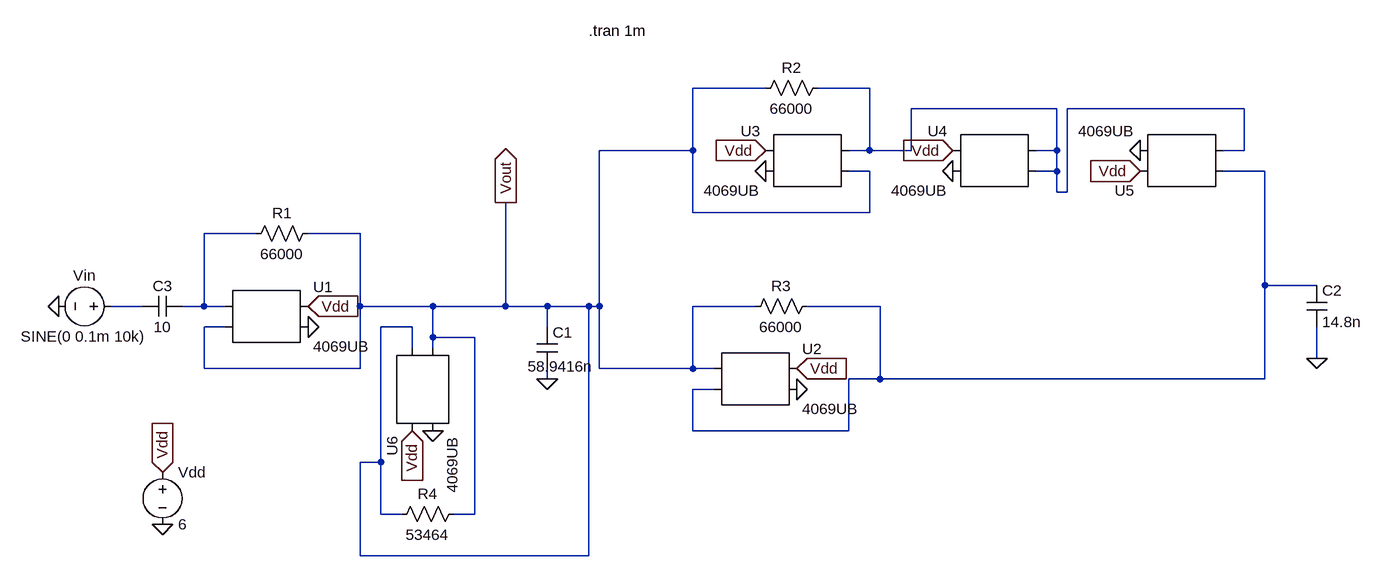
[diagram p0: schematic q2adv1.asc]
q2adv1.asc, the LTspice schematic file:
Version 4
SHEET 1 1144 680
WIRE 176 -368 64 -368
WIRE 336 -368 256 -368
WIRE 624 -336 400 -336
WIRE 912 -336 640 -336
WIRE 64 -272 64 -368
WIRE 64 -272 -80 -272
WIRE 336 -272 336 -368
WIRE 336 -272 304 -272
WIRE 400 -272 400 -336
WIRE 400 -272 336 -272
WIRE 624 -272 624 -336
WIRE 624 -272 592 -272
WIRE 912 -272 912 -336
WIRE 912 -272 880 -272
WIRE 336 -240 304 -240
WIRE 624 -240 624 -272
WIRE 624 -240 592 -240
WIRE 944 -240 880 -240
WIRE 624 -208 624 -240
WIRE 640 -208 640 -336
WIRE 640 -208 624 -208
WIRE 64 -176 64 -272
WIRE 336 -176 336 -240
WIRE 336 -176 64 -176
WIRE -608 -144 -688 -144
WIRE -448 -144 -528 -144
WIRE 944 -64 944 -240
WIRE 1024 -64 944 -64
WIRE -784 -32 -832 -32
WIRE -688 -32 -688 -144
WIRE -688 -32 -720 -32
WIRE -656 -32 -688 -32
WIRE -448 -32 -448 -144
WIRE -336 -32 -448 -32
WIRE -224 -32 -224 -192
WIRE -224 -32 -336 -32
WIRE -160 -32 -224 -32
WIRE -96 -32 -160 -32
WIRE -80 -32 -80 -272
WIRE -80 -32 -96 -32
WIRE 160 -32 64 -32
WIRE 352 -32 240 -32
WIRE -656 0 -688 0
WIRE -368 0 -416 0
WIRE -160 0 -160 -32
WIRE -336 16 -336 -32
WIRE -272 16 -336 16
WIRE -368 32 -368 0
WIRE -336 32 -336 16
WIRE 1024 48 1024 0
WIRE -688 64 -688 0
WIRE -448 64 -448 -32
WIRE -448 64 -688 64
WIRE -80 64 -80 -32
WIRE 64 64 64 -32
WIRE 64 64 -80 64
WIRE 96 64 64 64
WIRE -160 80 -160 64
WIRE 352 80 352 -32
WIRE 352 80 304 80
WIRE 944 80 944 -64
WIRE 944 80 352 80
WIRE 96 96 64 96
WIRE 64 160 64 96
WIRE 304 160 304 80
WIRE 304 160 64 160
WIRE -416 208 -416 0
WIRE -416 208 -448 208
WIRE -416 288 -416 208
WIRE -384 288 -416 288
WIRE -272 288 -272 16
WIRE -272 288 -304 288
WIRE -448 352 -448 208
WIRE -96 352 -96 -32
WIRE -96 352 -448 352
FLAG -912 -32 0
FLAG -160 80 0
FLAG -752 304 0
FLAG -752 224 Vdd
IOPIN -752 224 In
FLAG -528 -32 Vdd
IOPIN -528 -32 In
FLAG 176 -272 Vdd
IOPIN 176 -272 In
FLAG 464 -272 Vdd
IOPIN 464 -272 In
FLAG 752 -240 Vdd
IOPIN 752 -240 In
FLAG 224 64 Vdd
IOPIN 224 64 In
FLAG 224 96 0
FLAG -528 0 0
FLAG 176 -240 0
FLAG 464 -240 0
FLAG 752 -272 0
FLAG -224 -192 Vout
IOPIN -224 -192 Out
FLAG 1024 48 0
FLAG -368 160 Vdd
IOPIN -368 160 In
FLAG -336 160 0
SYMBOL AutoGenerated\\4069UB -592 -16 R0
SYMATTR InstName U1
SYMBOL voltage -816 -32 R90
WINDOW 0 -32 56 VBottom 2
WINDOW 3 31 58 VTop 2
WINDOW 123 60 56 VTop 2
WINDOW 39 0 0 Left 0
SYMATTR InstName Vin
SYMATTR Value SINE(0 0.1m 10k)
SYMBOL cap -176 0 R0
WINDOW 3 -14 61 Left 2
SYMATTR Value 58.9416n
SYMATTR InstName C1
SYMBOL AutoGenerated\\4069UB 160 80 R0
SYMATTR InstName U2
SYMBOL AutoGenerated\\4069UB 240 -256 M0
SYMATTR InstName U3
SYMBOL AutoGenerated\\4069UB 528 -256 M0
SYMATTR InstName U4
SYMBOL AutoGenerated\\4069UB 816 -256 R180
SYMATTR InstName U5
SYMBOL voltage -752 208 R0
WINDOW 123 0 0 Left 0
WINDOW 39 0 0 Left 0
SYMATTR InstName Vdd
SYMATTR Value 6
SYMBOL cap 1008 -64 R0
SYMATTR InstName C2
SYMATTR Value 14.8n
SYMBOL AutoGenerated\\4069UB -352 96 M90
SYMATTR InstName U6
SYMBOL res -512 -160 R90
WINDOW 0 0 56 VBottom 2
WINDOW 3 32 56 VTop 2
SYMATTR InstName R1
SYMATTR Value 66000
SYMBOL res 272 -384 R90
WINDOW 0 0 56 VBottom 2
WINDOW 3 32 56 VTop 2
SYMATTR InstName R2
SYMATTR Value 66000
SYMBOL res 256 -48 R90
WINDOW 0 0 56 VBottom 2
WINDOW 3 32 56 VTop 2
SYMATTR InstName R3
SYMATTR Value 66000
SYMBOL res -288 272 R90
WINDOW 0 0 56 VBottom 2
WINDOW 3 32 56 VTop 2
SYMATTR InstName R4
SYMATTR Value 53464
SYMBOL cap -720 -48 R90
WINDOW 0 0 32 VBottom 2
WINDOW 3 32 32 VTop 2
SYMATTR InstName C3
SYMATTR Value 10
TEXT -96 -456 Left 2 !.tran 1m

The netlist it stands for:
* q2adv1.asc
* U1: 4069UB (symbol AutoGenerated\4069UB not available, pins judged from their places): pin1=N003 pin2=Vout pin3=Vdd pin4=0
Vin N004 0 SINE(0 0.1m 10k)
C1 Vout 0 58.9416n
* U2: 4069UB (symbol AutoGenerated\4069UB not available, pins judged from their places): pin1=Vout pin2=N002 pin3=Vdd pin4=0
* U3: 4069UB (symbol AutoGenerated\4069UB not available, pins judged from their places): pin1=N001 pin2=Vout pin3=Vdd pin4=0
* U4: 4069UB (symbol AutoGenerated\4069UB not available, pins judged from their places): pin1=N001 pin2=N001 pin3=Vdd pin4=0
* U5: 4069UB (symbol AutoGenerated\4069UB not available, pins judged from their places): pin1=N002 pin2=N001 pin3=Vdd pin4=0
Vdd Vdd 0 6
C2 N002 0 14.8n
* U6: 4069UB (symbol AutoGenerated\4069UB not available, pins judged from their places): pin1=Vout pin2=Vout pin3=Vdd pin4=0
R1 Vout N003 66000
R2 N001 Vout 66000
R3 N002 Vout 66000
R4 Vout Vout 53464
C3 N003 N004 10
.tran 1m
.backanno
.end